# Altium schematic sheet Antenna.SchDoc: Antenna Switch
size Legal; CheckedBy: J. Brinton; CompanyName: Signal Laboratories, Inc.; DrawnBy: J. Brinton; Engineer: J. Brinton; Address1: 3479 Edison Way; Address2: Menlo Park CA 94025; Address3: +1 (877) 778-8435; Address4: siglabs.com; DocumentNumber: 47; Revision: 1; SheetNumber: 48; SheetTotal: 58
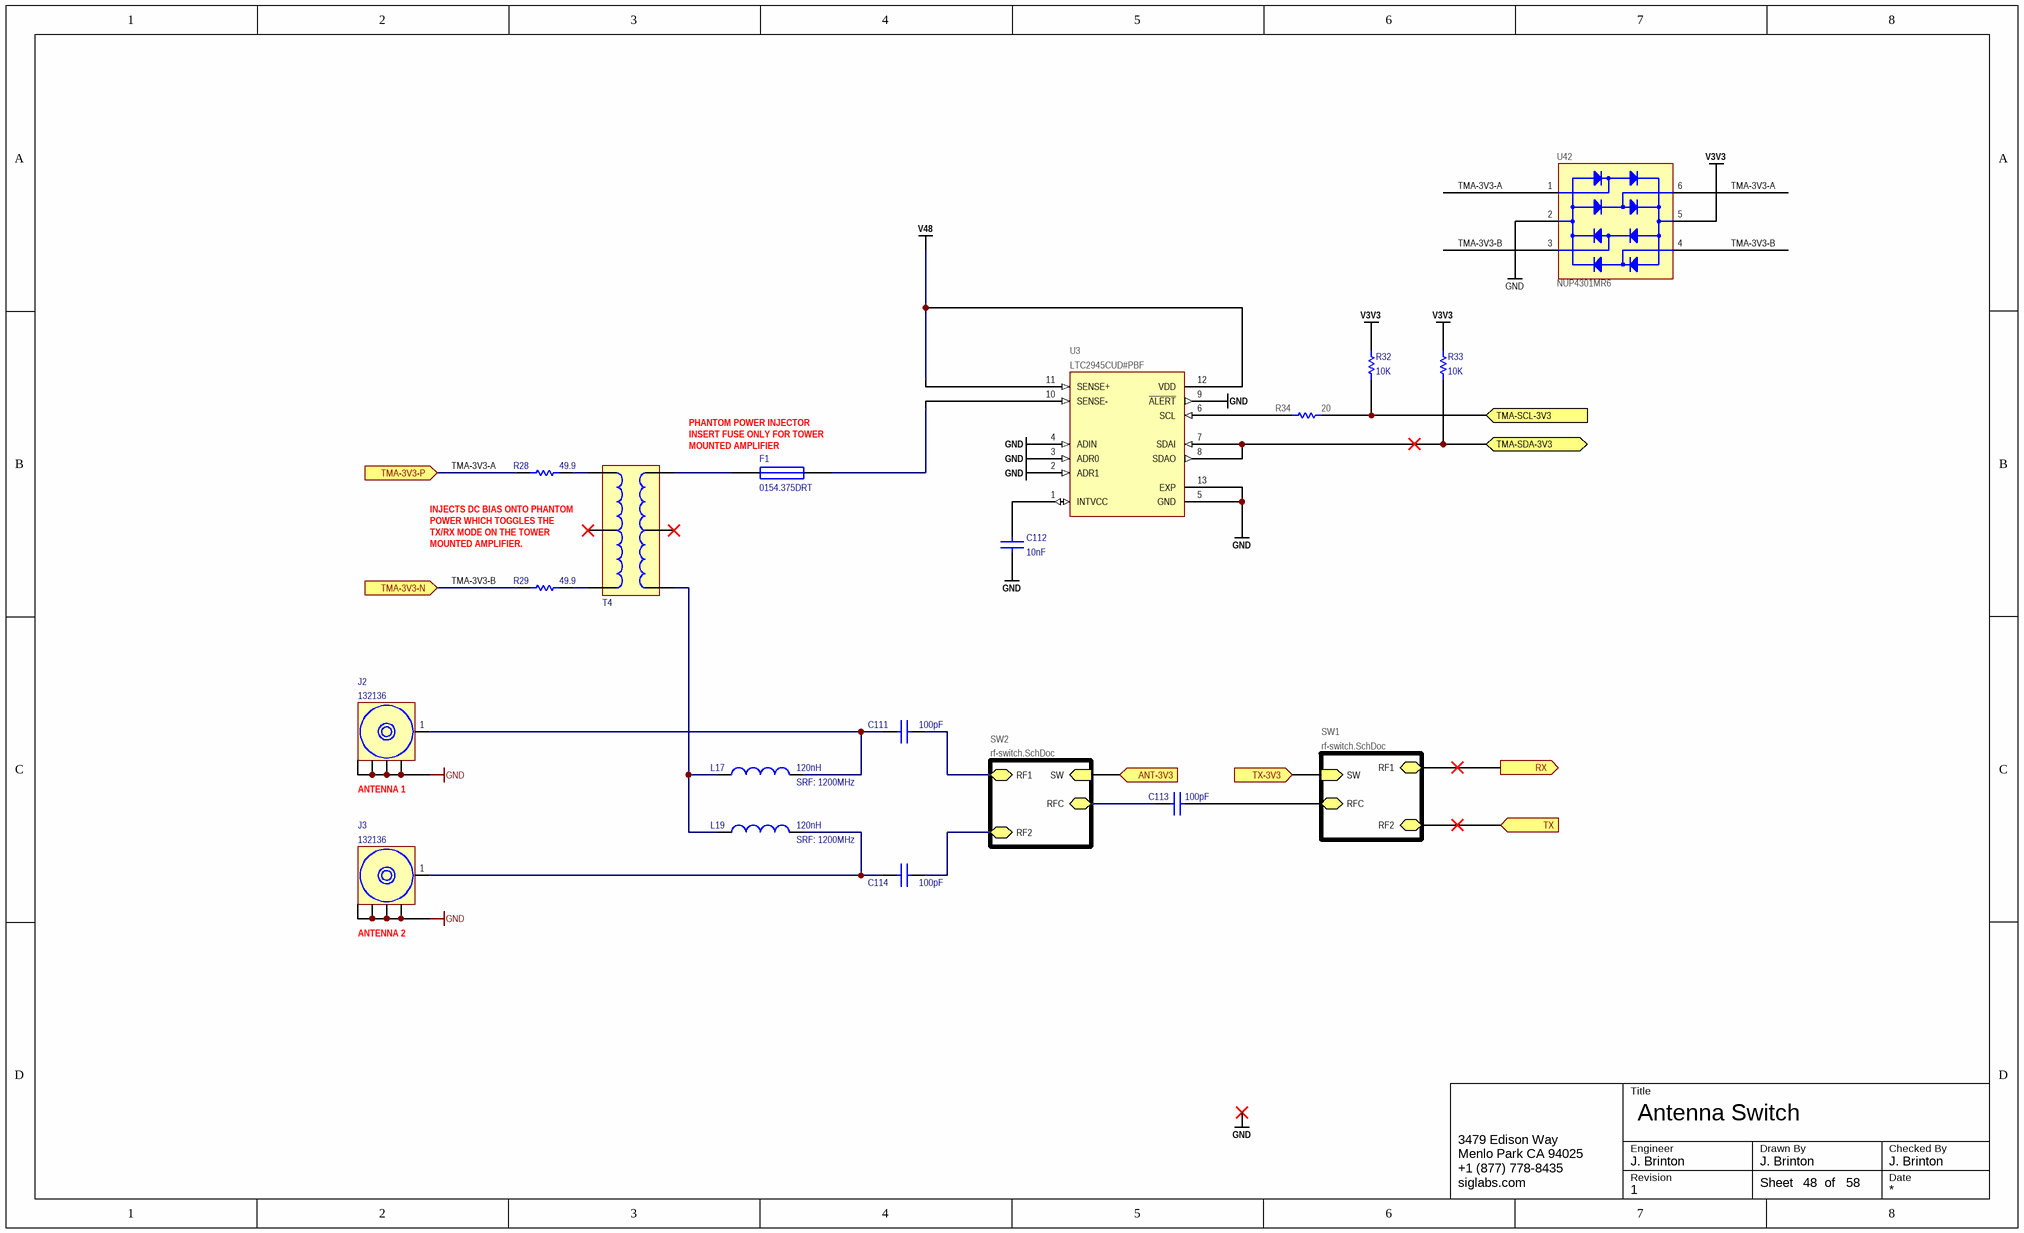
[diagram p0: Antenna.SchDoc]

## Parts
C111  value 100pF  [CAPC100X50X55L25N]  (hidden comment: C0402C101J1GAC7867)
C112  value 10nF  [CAPC100X50X55L25N]  (hidden comment: GRM155R71H103KA88)
C113  value 100pF  [CAPC100X50X55L25N]  (hidden comment: CBR04C101F3GAC)
C114  value 100pF  [CAPC100X50X55L25N]  (hidden comment: C0402C101J1GAC7867)
F1  0154.375DRT  [154]
J2  132136  [132136]
J3  132136  [132136]
L17  value 120nH  SRF: 1200MHz  [0603]  (hidden comment: LQW18CNR12J00D)
L19  value 120nH  SRF: 1200MHz  [0603]  (hidden comment: LQW18CNR12J00D)
R28  value 49.9  [0603]  (hidden comment: ERJ-3EKF49R9V)
R29  value 49.9  [0603]  (hidden comment: ERJ-3EKF49R9V)
R32  value 10K  [RESC1005X40N]  (hidden comment: ERJ-2RKF1002X)
R33  value 10K  [RESC1005X40N]  (hidden comment: ERJ-2RKF1002X)
R34  value 20  [RESC1005X40N]  (hidden comment: ERJ-2RKF20R0X)
T4  78253/35JC-R  [78253/35JC-R]  (value not drawn)
U3  LTC2945CUD#PBF  [QFN50P300X300X80-13N]
U42  NUP4301MR6  [SOT23-6]

## Sub-sheets
SW1 = rf-switch.SchDoc: SW (in), RFC (bidir), RF1 (bidir), RF2 (bidir)
SW2 = rf-switch.SchDoc: SW (in), RFC (bidir), RF1 (bidir), RF2 (bidir)

## Ports
ANT-3V3 (in), RX (out), TMA-3V3-N (in), TMA-3V3-P (in), TMA-SCL-3V3 (in), TMA-SDA-3V3 (bidir), TX (in), TX-3V3 (in)

## Nets
GND: C112.1 J2.2(GND) J2.3(GND) J2.4(GND) J2.5(GND) J3.2(GND) J3.3(GND) J3.4(GND) J3.5(GND) U3.2(ADR1) U3.3(ADR0) U3.4(ADIN) U3.5(GND) U3.9(~{ALERT}) U3.13(EXP) U42.2(VN)
V3V3: R32.2 R33.2 U42.5(VP)
V48: U3.11(SENSE+) U3.12(VDD)
ANT-3V3: port ANT-3V3, sheet SW2/SW
RX: port RX, sheet SW1/RF1
TMA-3V3-A: R28.1 U42.1(A) U42.6(D) ; port TMA-3V3-P
TMA-3V3-B: R29.1 U42.3(B) U42.4(C) ; port TMA-3V3-N
TMA-SCL-3V3: R32.1 R34.2 ; port TMA-SCL-3V3
TMA-SDA-3V3: R33.1 U3.7(SDAI) U3.8(SDAO) ; port TMA-SDA-3V3
TX: port TX, sheet SW1/RF2
TX-3V3: port TX-3V3, sheet SW1/SW
NetC111_1: C111.1 ; sheet SW2/RF1
NetC111_2: C111.2 J2.1(CENTER) L17.2
NetC112_2: C112.2 U3.1(INTVCC)
NetC113_1: C113.1 ; sheet SW1/RFC
NetC113_2: C113.2 ; sheet SW2/RFC
NetC114_1: C114.1 ; sheet SW2/RF2
NetC114_2: C114.2 J3.1(CENTER) L19.2
NetF1_1: F1.1 T4.6
NetF1_2: F1.2 U3.10(SENSE-)
NetL17_1: L17.1 L19.1 T4.4
NetR28_2: R28.2 T4.1
NetR29_2: R29.2 T4.3
NetR34_1: R34.1 U3.6(SCL)

Not connected (* = marked no-connect by the designer): T4 2* 5*

## Notes on the sheet
- (near F1) PHANTOM POWER INJECTOR
  INSERT FUSE ONLY FOR TOWER MOUNTED AMPLIFIER
- (near R29) INJECTS DC BIAS ONTO PHANTOM POWER WHICH TOGGLES THE TX/RX MODE ON THE TOWER MOUNTED AMPLIFIER.
- (near J2) ANTENNA 1
- (near J3) ANTENNA 2
- Labels drawn without touching a wire or pin: GND
- Title
- Engineer
- Revision
- Drawn By
- Checked By
- Date
- Sheet
- of

## Library data of the parts
C111 C114 = CAP 0603: Ceramic Capacitor 100pF ±5% 100V NP0 0402; Manufacturer: Kemet; Tr: -55:125; Voltage: 100V; Manufacturer P/N: C0402C101J1GAC7867; Package: CAPC100X50X55L25N; Do Not Place: *; Tolerance: ±5%
C112 = CAP 0402: Ceramic Capacitor 10nF ±10% 50V X7R 0402; Manufacturer: Murata; Tr: -55:125; Voltage: 50V; Manufacturer P/N: GRM155R71H103KA88; Package: 0402; Tolerance: ±10%
C113 = CAP 0603: Ceramic Capacitor 100pF ±1% 25V NP0 0402; Manufacturer: Kemet; Tr: -55:125; Voltage: 25V; Manufacturer P/N: CBR04C101F3GAC; Package: CAPC100X50X55L25N; Do Not Place: *; Tolerance: ±1%
F1 = Fuse 1: 154 OMNI-BLOK 0.375A Fuse and Holder; Manufacturer: Littelfuse; Manufacturer P/N: 0154.375DRT
J2 J3 = 132136: SMA Right Angle Connector COAX Female; Manufacturer: Amphenol; Manufacturer P/N: 132136
L17 L19 = IND 0603: Wirewound Inductor 120nH 1.1A 0603; Manufacturer: Murata; Manufacturer P/N: LQW18CNR12J00D; PCB Package: 0603; Do Not Place: *
R28 R29 = RES 0603: Thick Film Resistor 49.9 ±1% 0603; Manufacturer: Panasonic; Tr: -55:155; Package: 0603; Manufacturer P/N: ERJ-3EKF49R9V; Tolerance: ±1%
R32 R33 = RES 0402: Thick Film 10k ±1% 0402; Manufacturer: Panasonic; Tr: -55:155; Package: 0402; Manufacturer P/N: ERJ-2RKF1002X; Tolerance: ±1%
R34 = RES: Thick Film Resistor 20 ±1% 0.1W 75V 0402; Manufacturer: Panasonic; Tcr: ±100; Tr: -55:155; Voltage: 75; Power: 0.1; Tolerance: ±1%; Manufacturer P/N: ERJ-2RKF20R0X; Alternatives: *; Footprint: *; Package: 0402
T4 = 78253/35JC-R: Transformer; Manufacturer: MuRata; Manufacturer P/N: 78253/35JC-R
U3 = LTC2945CUD#PBF: MS-System Monitor/Other Wide Range I2C Power Monitor %28SDAO%29; MF: Linear Technology; MP: LTC2945CUD#PBF; Price: 5.52 USD; Availability: Warning; Package: None; Value: *
U42 = NUP4301MR6: 4-Lane TVS Diode Array; Manufacturer: On Semiconductor; Manufacturer P/N: NUP4301MR6